# EasyEDA schematic ESP32 Screen.json
TITLE: Sheet_1; REV: 1.0; Date: 2025-04-23; Sheet: 1/1; Company: Your Company
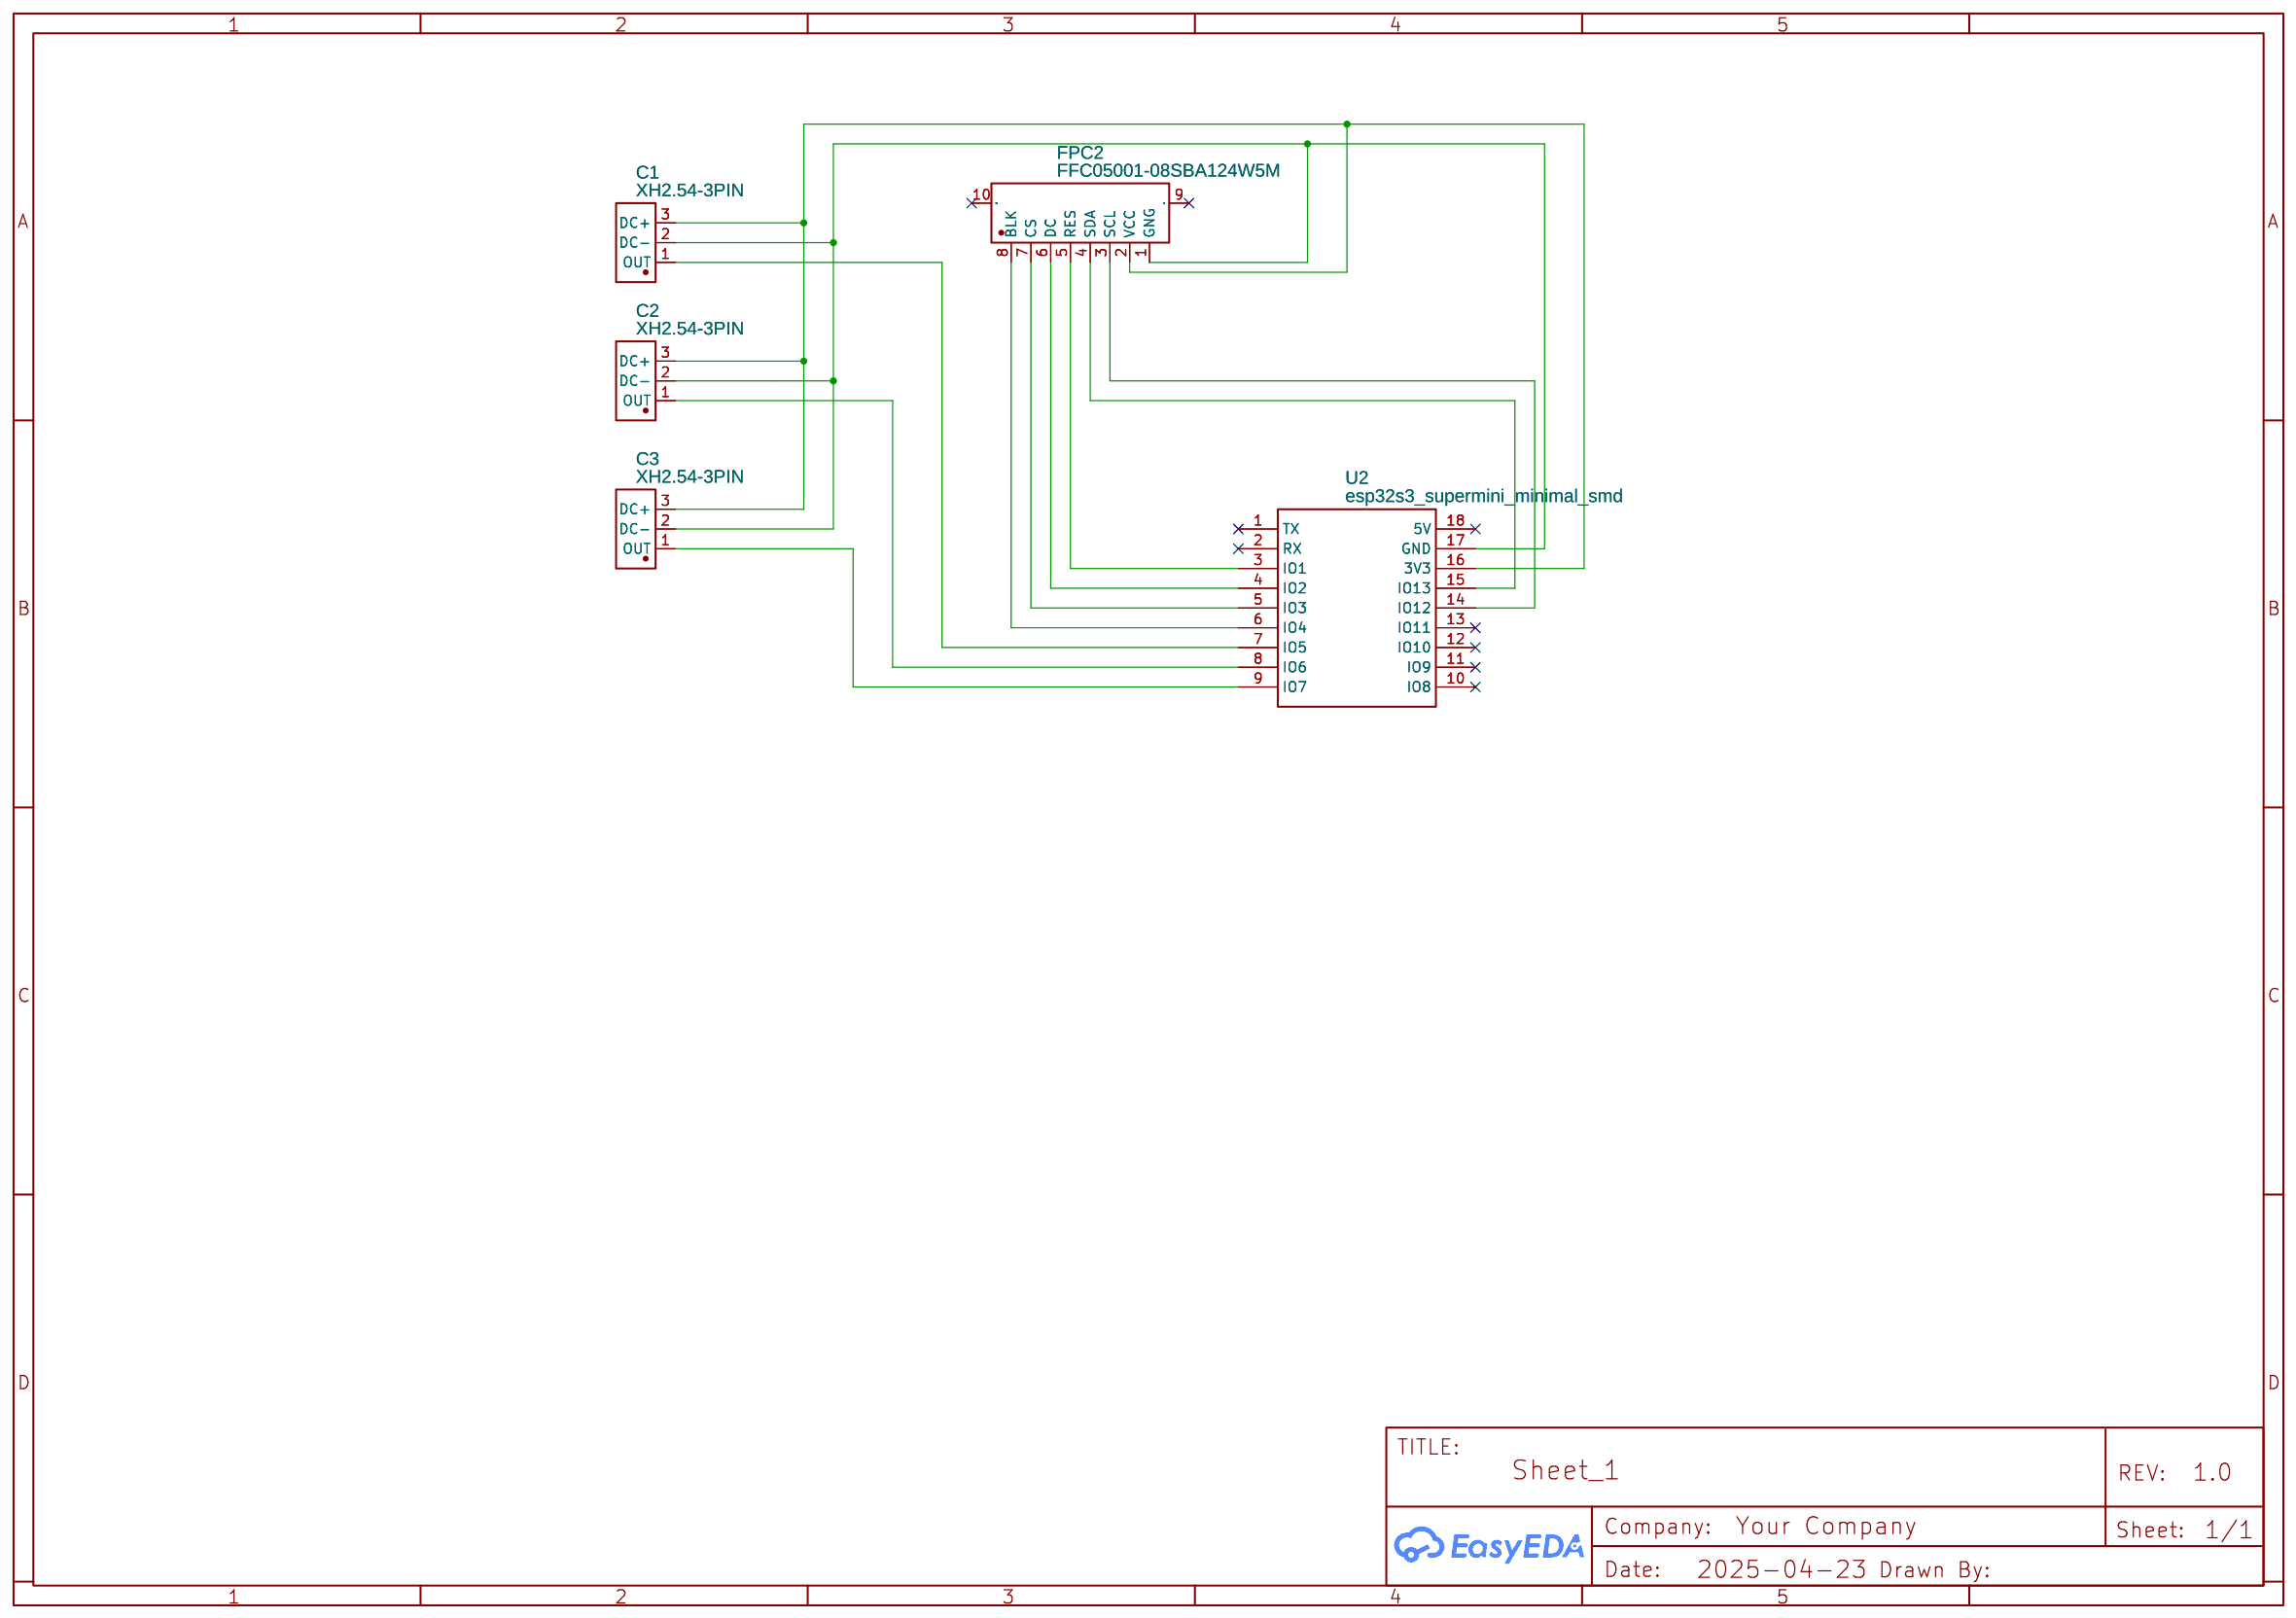
[diagram p0: schematic sheet]

## Parts
C1  XH2.54-3PIN  [XH2.54-3PIN_TH]
C2  XH2.54-3PIN  [XH2.54-3PIN_TH]
C3  XH2.54-3PIN  [XH2.54-3PIN_TH]
FPC2  FFC05001-08SBA124W5M  [FFC-SMD_FFC05001-08SBA124W5M]
U2  esp32s3_supermini_minimal_smd  [ESP32_S3_SUPERMINI_MINIMAL_SMD]

## Library data of the parts
C1-C3 = XH2.54-3PIN: Contributor: anlpereira; Supplier: LCSC; Supplier Part: C9900014913; Manufacturer: null; JLCPCB Part Class: Extended Part
FPC2 = FFC05001-08SBA124W5M: Contributor: LCSC; Supplier: LCSC; Supplier Part: C456419; Manufacturer: TXGA(特思嘉); JLCPCB Part Class: Extended Part
U2 = esp32s3_supermini_minimal_smd: Contributor: Joe Ostrander

## Nets
Net-(C1-1): C1.1(OUT) U2.7(IO5)
Net-(C1-2): C1.2(DC-) C2.2(DC-) C3.2(DC-) FPC2.1(GNG) U2.17(GND)
Net-(C1-3): C1.3(DC+) C2.3(DC+) C3.3(DC+) FPC2.2(VCC) U2.16(3V3)
Net-(C2-1): C2.1(OUT) U2.8(IO6)
Net-(C3-1): C3.1(OUT) U2.9(IO7)
Net-(FPC2-3): FPC2.3(SCL) U2.14(IO12)
Net-(FPC2-4): FPC2.4(SDA) U2.15(IO13)
Net-(FPC2-5): FPC2.5(RES) U2.3(IO1)
Net-(FPC2-6): FPC2.6(DC) U2.4(IO2)
Net-(FPC2-7): FPC2.7(CS) U2.5(IO3)
Net-(FPC2-8): FPC2.8(BLK) U2.6(IO4)

Not connected (* = marked no-connect by the designer): FPC2 9* 10*; U2 1(TX)* 2(RX)* 10(IO8)* 11(IO9)* 12(IO10)* 13(IO11)* 18(5V)*
